# Altium schematic sheet SheetPainel.SchDoc
size A4; SheetNumber: 1; SheetTotal: 1
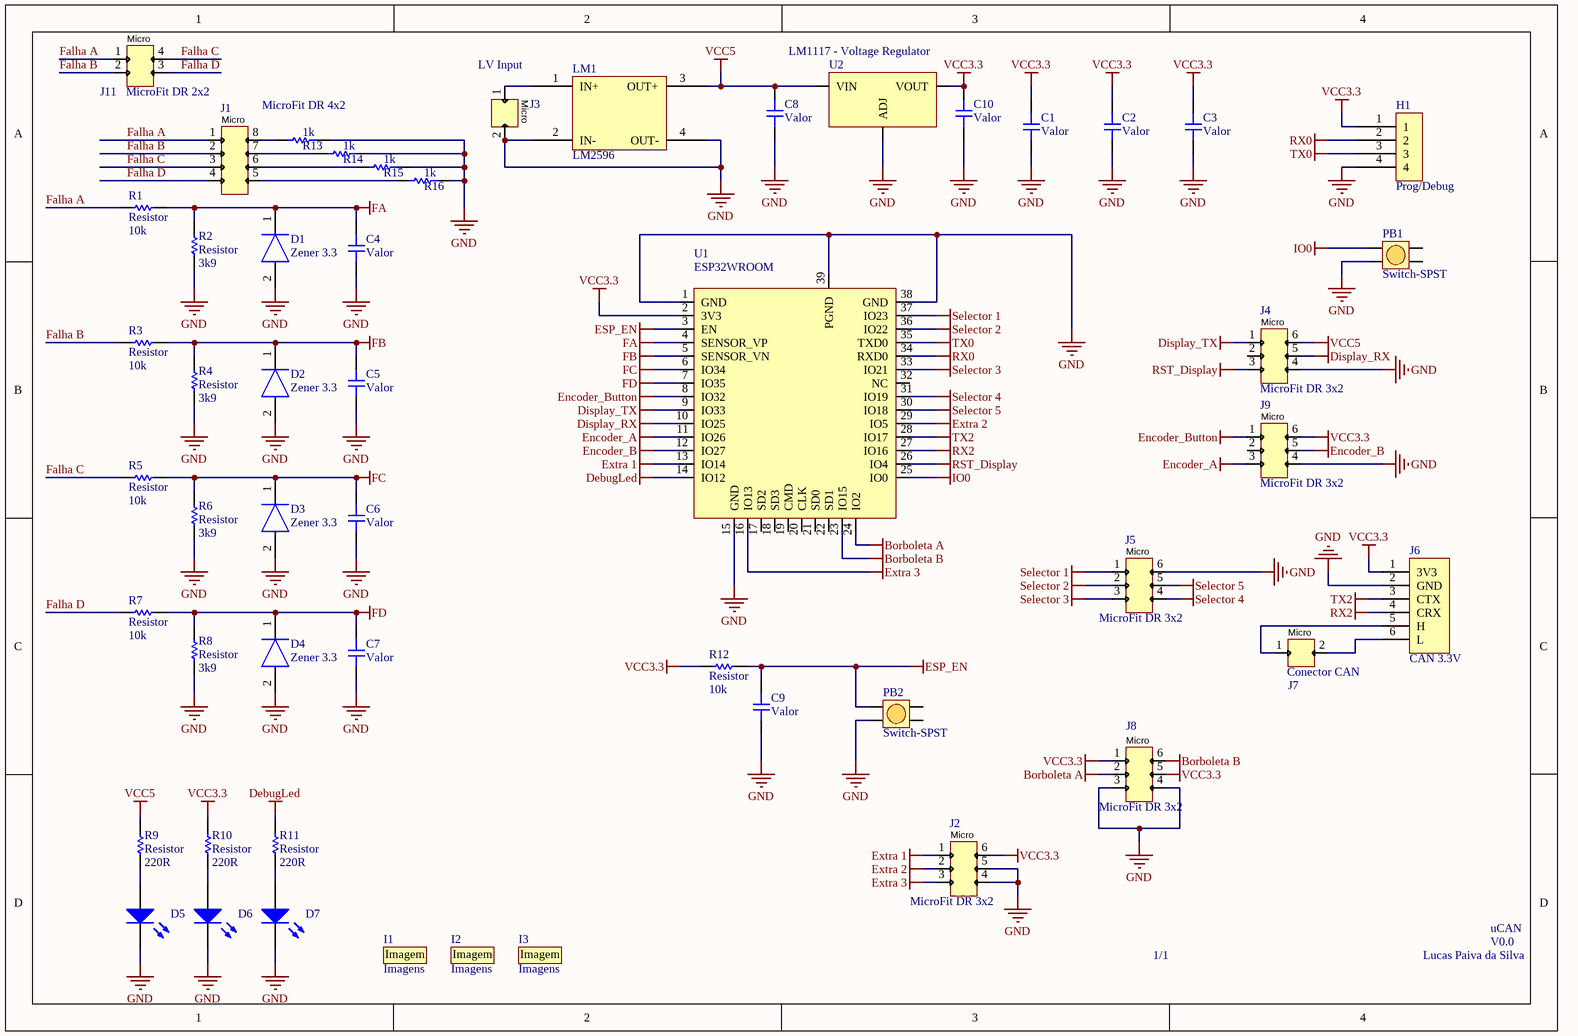
[diagram p0: SheetPainel.SchDoc]

## Parts
C1  Valor  [SMD0805C]
C2  Valor  [SMD0805C]
C3  Valor  [SMD0805C]
C4  Valor  [SMD0805C]
C5  Valor  [SMD0805C]
C6  Valor  [SMD0805C]
C7  Valor  [SMD0805C]
C8  Valor  [SMD0805C]
C9  Valor  [SMD0805C]
C10  Valor  [SMD0805C]
D1  Zener 3.3  [CD1408-FU1800]
D2  Zener 3.3  [CD1408-FU1800]
D3  Zener 3.3  [CD1408-FU1800]
D4  Zener 3.3  [CD1408-FU1800]
D5  LED_SMD  [1206_LED]  (value not drawn)
D6  LED_SMD  [1206_LED]  (value not drawn)
D7  LED_SMD  [1206_LED]  (value not drawn)
H1  Prog/Debug  [Pin Header 1x4 TH Pitch 2.54mm]
I1  Imagens  [CARROAMPERA]
I2  Imagens  [LOGO AMPERA]
I3  Imagens  [LOGO CIRCUIBRAS]
J1  MicroFit DR 4x2  [MICRO-FIT 4X2 180° TE]
J2  MicroFit DR 3x2  [MICRO-FIT 3x2 180º MULT]
J3  LV Input  [MICRO-FIT 2X1 180° TE]
J4  MicroFit DR 3x2  [MICRO-FIT 3x2 180º MULT]
J5  MicroFit DR 3x2  [MICRO-FIT 3x2 180º MULT]
J6  CAN 3.3V  [CAN3v3]
J7  Conector CAN  [MICRO-FIT 2X1 180° TE]
J8  MicroFit DR 3x2  [MICRO-FIT 3x2 180º MULT]
J9  MicroFit DR 3x2  [MICRO-FIT 3x2 180º MULT]
J11  MicroFit DR 2x2  [MICRO-FIT 2x2 180º TE]
LM1  LM2596  [LM2596]
PB1  Switch-SPST  [TACTILE-6X6]
PB2  Switch-SPST  [TACTILE-6X6]
R1  Resistor  value 10k  [RES0805R]
R2  Resistor  value 3k9  [RES0805R]
R3  Resistor  value 10k  [RES0805R]
R4  Resistor  value 3k9  [RES0805R]
R5  Resistor  value 10k  [RES0805R]
R6  Resistor  value 3k9  [RES0805R]
R7  Resistor  value 10k  [RES0805R]
R8  Resistor  value 3k9  [RES0805R]
R9  Resistor  value 220R  [RES0805R]
R10  Resistor  value 220R  [RES0805R]
R11  Resistor  value 220R  [RES0805R]
R12  Resistor  value 10k  [RES0805R]
R13  1k  [SMD0805R]
R14  1k  [SMD0805R]
R15  1k  [SMD0805R]
R16  1k  [SMD0805R]
U1  ESP32WROOM  [ESP32WROOM]
U2  LM1117 - Voltage Regulator  [SOT223]

## Nets
Borboleta A: J8.2 U1.24(IO2)
Borboleta B: J8.6 U1.23(IO15)
DebugLed: R11.1 U1.14(IO12)
Display_RX: J4.5 U1.10(IO25)
Display_TX: J4.1 U1.9(IO33)
Encoder_A: J9.3 U1.11(IO26)
Encoder_B: J9.5 U1.12(IO27)
Encoder_Button: J9.1 U1.8(IO32)
ESP_EN: C9.2 PB2.1 R12.1 U1.3(EN)
Extra 1: J2.1 U1.13(IO14)
Extra 2: J2.2 U1.29(IO5)
Extra 3: J2.3 U1.16(IO13)
FA: C4.2 D1.1(K) R1.1 R2.1 U1.4(SENSOR_VP)
FB: C5.2 D2.1(K) R3.1 R4.1 U1.5(SENSOR_VN)
FC: C6.2 D3.1(K) R5.2 R6.2 U1.6(IO34)
FD: C7.2 D4.1(K) R7.1 R8.1 U1.7(IO35)
GND: C1.1 C2.1 C3.1 C4.1 C5.1 C6.1 C7.1 C8.1 C9.1 C10.1 D1.2(A) D2.2(A) D3.2(A) D4.2(A) D5.K D6.K D7.K H1.4 J2.4 J2.5 J3.2 J4.4 J5.6 J6.2(GND) J8.3 J8.4 J9.4 LM1.2(IN-) LM1.4(OUT-) PB1.2 PB2.2 R2.2 R4.2 R6.1 R8.2 R13.2 R14.2 R15.2 R16.2 U1.1(GND) U1.15(GND) U1.38(GND) U1.39(PGND) U2.1(ADJ)
IO0: PB1.1 U1.25(IO0)
RST_Display: J4.3 U1.26(IO4)
RX0: H1.2 U1.34(RXD0)
RX2: J6.4(CRX) U1.27(IO16)
Selector 1: J5.1 U1.37(IO23)
Selector 2: J5.2 U1.36(IO22)
Selector 3: J5.3 U1.33(IO21)
Selector 4: J5.4 U1.31(IO19)
Selector 5: J5.5 U1.30(IO18)
TX0: H1.3 U1.35(TXD0)
TX2: J6.3(CTX) U1.28(IO17)
VCC3.3: C1.2 C2.2 C3.2 C10.2 H1.1 J2.6 J6.1(3V3) J8.1 J8.5 J9.6 R10.1 R12.2 U1.2(3V3) U2.2(VOUT)
VCC5: C8.2 J4.6 LM1.3(OUT+) R9.1 U2.3(VIN)
Falha A: J1.1 J11.1 R1.2
Falha B: J1.2 J11.2 R3.2
Falha C: J1.3 J11.4 R5.1
Falha D: J1.4 J11.3 R7.2
NetD5_A: D5.A R9.2
NetD6_A: D6.A R10.2
NetD7_A: D7.A R11.2
NetJ1_5: J1.5 R16.1
NetJ1_6: J1.6 R15.1
NetJ1_7: J1.7 R14.1
NetJ1_8: J1.8 R13.1
NetJ3_1: J3.1 LM1.1(IN+)
NetJ6_5: J6.5(H) J7.1
NetJ6_6: J6.6(L) J7.2

Not connected (* = marked no-connect by the designer): J4 2; J9 2; PB1 3 4; PB2 3 4; U1 17(SD2) 18(SD3) 19(CMD) 20(CLK) 21(SD0) 22(SD1) 32(NC)

## Notes on the sheet
- 1/1
- Lucas Paiva da Silva
- uCAN
- V0.0
- (in symbol Imagens) Imagem
- (in symbol MicroFit DR 1x2) Micro
- (in symbol MicroFit DR 2x2) Micro
- (in symbol MicroFit DR 3x2) Micro
- (in symbol MicroFit DR 4x2) Micro

## Library data of the parts
C1-C10 = Capacitor
D1-D4 = CD1408-FU1800: Diode Ultrafast
D5-D7 = LED_SMD: Hyper PointLED long life, white, colored diffused, enhanced optical power LED (ThinGaN), SMT Top Emitter, Round Miniature Package, Reverse Mount; PCB_Layout: Complies with manufacturer's recommendation.; Published: 14-Mar-2008; DatasheetVersion: Mar-2007; PackageVersion: Mar-2007; PackageReference: LWP4SG; Publisher: Altium Limited; PackageDescription: White LED; 2 Reverse Gullwing Leads, Body 1.9 x 0.875mm (Dia.xH); ComponentLink1Description: Manufacturer Link; ComponentLink1URL: http://www.osram-os.com/; ComponentLink2Description: Datasheet; ComponentLink2URL: http://catalog.osram-os.com/catalogue/catalogue.do;jsessionid=AD571800CED0208623E7FAFDF556DB1C?act=downloadFile&favOid=020000030001e106000200b6
H1 = HEADER_4: Header 4-pin
I1-I3 = Imagens: Imagem para retorno
J3 J7 = MicroFit DR 1x2
J6 = CAN 3.3V: CAN Module Acelerometro e giroscopio 3 eixos (I2C)
LM1 = LM2596: Voltage Converter
R1-R12 = Resistor-SMD: Published: 8-Jun-2000; LatestRevisionDate: 17-Jul-2002; LatestRevisionNote: Re-released for DXP Platform.; PackageReference: AXIAL-0.3; Publisher: Altium Limited; PackageDescription: Axial Device, Thru-Hole; 2 Leads; 0.3 in Pin Spacing
R13-R16 = Resistor